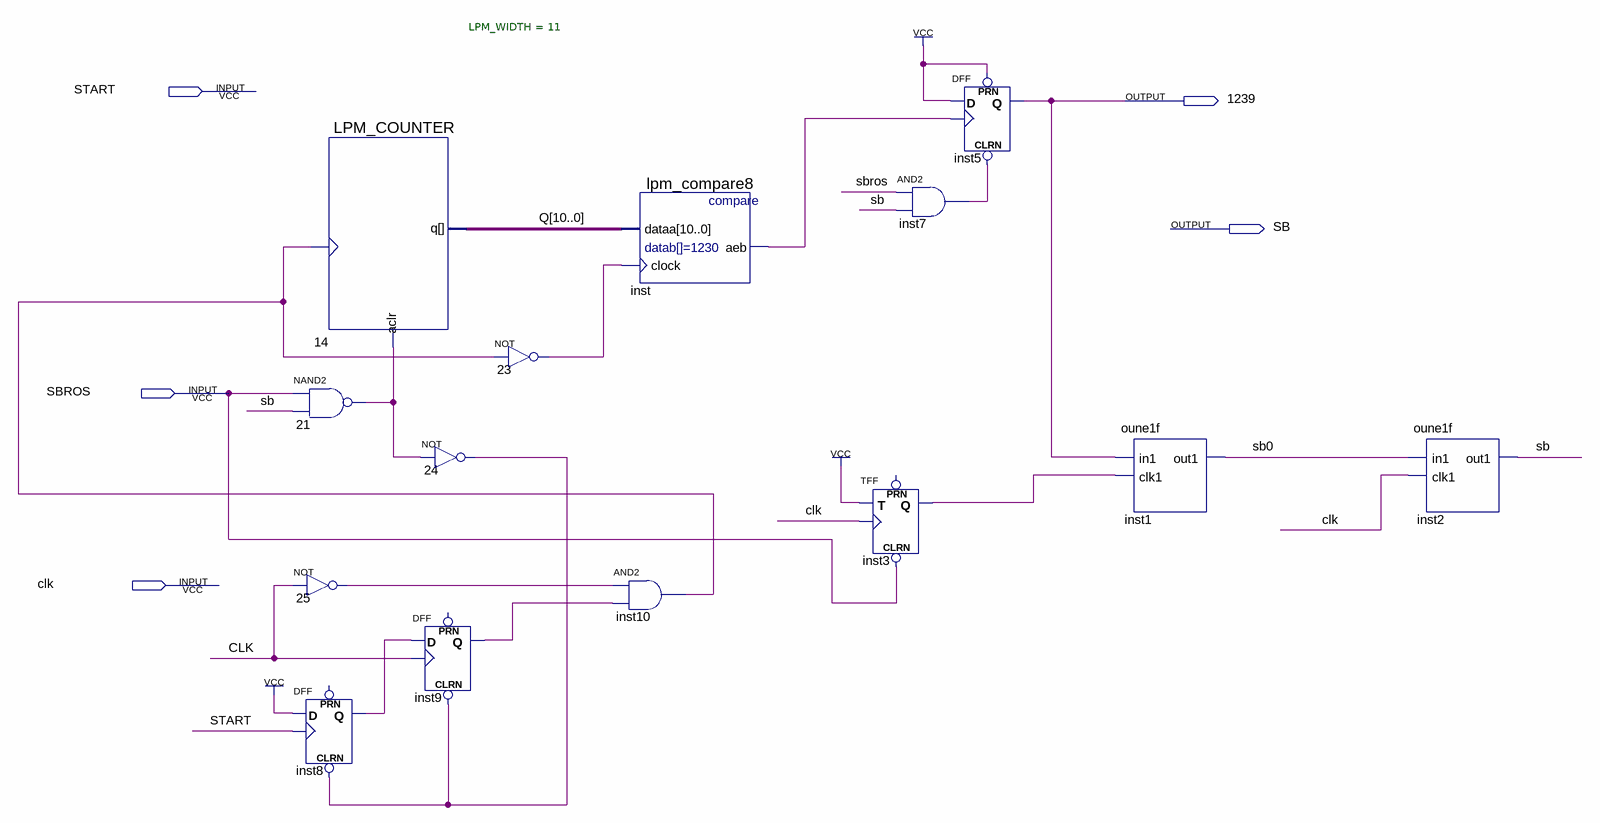
[diagram p0: schematic sheet]
// Quartus schematic count1239_2018.bdf as structural Verilog: 14 symbols, 5 pins
module count1239_2018 (
  input  START,
  input  SBROS,
  input  clk,
  output \1239 ,
  output SB
);

  wire inst3_q, inst7_out, inst8_q, inst9_q, inst10_out, inst_aeb, n21_out, n23_out, n24_out, n25_out, sb0;
  wire [10:0] Q;

  LPM_COUNTER #(.LPM_WIDTH(11)) u_14 (.clock(inst10_out), .aclr(n21_out), .q(Q));
  nand u_21 (n21_out, SBROS, SB);
  not u_25 (n25_out, clk);
  DFF inst8 (.CLRN(n24_out), .CLK(START), .D(1'b1), .Q(inst8_q));  // open: PRN
  not u_24 (n24_out, n21_out);
  DFF inst9 (.CLRN(n24_out), .CLK(clk), .D(inst8_q), .Q(inst9_q));  // open: PRN
  not u_23 (n23_out, inst10_out);
  lpm_compare8 inst (.dataa(Q), .clock(n23_out), .aeb(inst_aeb));
  and inst10 (inst10_out, n25_out, inst9_q);
  and inst7 (inst7_out, SBROS, SB);
  TFF inst3 (.CLRN(SBROS), .T(1'b1), .CLK(clk), .Q(inst3_q));  // open: PRN
  DFF inst5 (.CLRN(inst7_out), .CLK(inst_aeb), .D(1'b1), .PRN(1'b1), .Q(\1239 ));
  oune1f inst1 (.in1(\1239 ), .clk1(inst3_q), .out1(sb0));
  oune1f inst2 (.in1(sb0), .clk1(clk), .out1(SB));
endmodule
